# EAGLE design TheLittleEngineers.org-27C512E-TO-2532S-V1R0.20.APRIL.2019 (EAGLE 9.3.2)
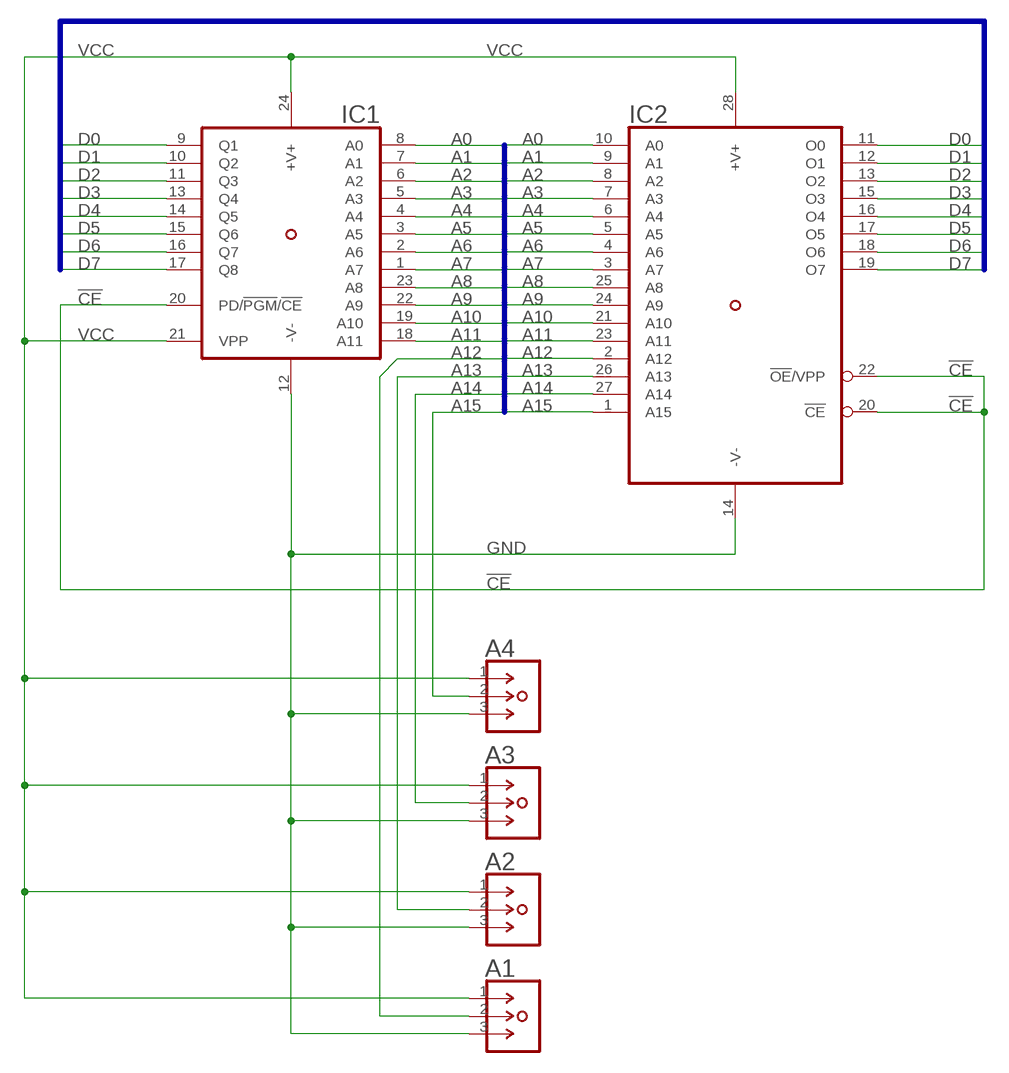
[diagram p0: schematic, sheet 1]

## Parts
A1  HEADER-1X03-STAGGERED-S  [HEADER-1X03-STAGGERED]
A2  HEADER-1X03-STAGGERED-S  [HEADER-1X03-STAGGERED]
A3  HEADER-1X03-STAGGERED-S  [HEADER-1X03-STAGGERED]
A4  HEADER-1X03-STAGGERED-S  [HEADER-1X03-STAGGERED]
IC1  2532-NO  [DIL24-6-NO-OUTLINE]
IC2  27C512D-NO  [DIL28-6-NO-OUTLINE]

## Nets
!CE: IC1.20(PD/!PGM!/!CE) IC2.20(!CE) IC2.22(!OE!/VPP)
A0: IC1.8(A0) IC2.10(A0)
A1: IC1.7(A1) IC2.9(A1)
A2: IC1.6(A2) IC2.8(A2)
A3: IC1.5(A3) IC2.7(A3)
A4: IC1.4(A4) IC2.6(A4)
A5: IC1.3(A5) IC2.5(A5)
A6: IC1.2(A6) IC2.4(A6)
A7: IC1.1(A7) IC2.3(A7)
A8: IC1.23(A8) IC2.25(A8)
A9: IC1.22(A9) IC2.24(A9)
A10: IC1.19(A10) IC2.21(A10)
A11: IC1.18(A11) IC2.23(A11)
A12: A1.2 IC2.2(A12)
A13: A2.2 IC2.26(A13)
A14: A3.2 IC2.27(A14)
A15: A4.2 IC2.1(A15)
D0: IC1.9(Q1) IC2.11(O0)
D1: IC1.10(Q2) IC2.12(O1)
D2: IC1.11(Q3) IC2.13(O2)
D3: IC1.13(Q4) IC2.15(O3)
D4: IC1.14(Q5) IC2.16(O4)
D5: IC1.15(Q6) IC2.17(O5)
D6: IC1.16(Q7) IC2.18(O6)
D7: IC1.17(Q8) IC2.19(O7)
GND [power]: A1.3 A2.3 A3.3 A4.3 IC1.12(-V-) IC2.14(-V-)
VCC [power]: A1.1 A2.1 A3.1 A4.1 IC1.21(VPP) IC1.24(+V+) IC2.28(+V+)

## Buses
D[0..7]
A[0..15]

## Library data of the parts
A1-A4 = 27C512E-TO-2532S-V1R0.20.APRIL.2019-JOHN.ROESNER:HEADER-1X03-STAGGERED: 3-Pin SIP Header Copyright ©07 Jan 2013, by: Robert "The R.A.T." Allen Turner http://www.TheLittleEngineers.org/ TheLittleEngineers@outlook.com OurLittleEngineers@gMail.com You may use these components in your own projects, however, please take note that we CANNOT guarantee the accuracy of these components (nor any part of this library). We make NO guarantees that the components, footprints or schematic symbols in this library are flawless, and we make no promises of fitness for production, prototyping or any other purpose. These libraries are provided for informational purposes only, and are used at your own discretion. By downloading these libraries, you agree that we cannot be held responsible for faulty PCBs. You should always check the footprints with a 1:1 printout. Neither Robert Allen Turner, The Little Engineers <http://www.TheLittleEngineers.org/>, TheLittleEngineers.org, nor anyone affiliated with same shall be held responsible for any outcome resulting from the usage of these files. Should any errors be found, please contact us at one of the above email addresses and we will attempt to repair them. Unless otherwise noted, content of this library is licensed under a Creative Commons Attribution-ShareAlike 4.0 International (CC BY-SA 4.0) license (https://creativecommons.org/licenses/by-sa/4.0/) on 20 April 2019 in memory of my Father, Robert Embry Turner - I LOVE YOU DAD!
IC1 = 27C512E-TO-2532S-V1R0.20.APRIL.2019-JOHN.ROESNER:2532: TMS2532 Copyright ©07 Jan 2013, by: Robert "The R.A.T." Allen Turner http://www.TheLittleEngineers.org/ TheLittleEngineers@outlook.com OurLittleEngineers@gMail.com You may use these components in your own projects, however, please take note that we CANNOT guarantee the accuracy of these components (nor any part of this library). We make NO guarantees that the components, footprints or schematic symbols in this library are flawless, and we make no promises of fitness for production, prototyping or any other purpose. These libraries are provided for informational purposes only, and are used at your own discretion. By downloading these libraries, you agree that we cannot be held responsible for faulty PCBs. You should always check the footprints with a 1:1 printout. Neither Robert Allen Turner, The Little Engineers <http://www.TheLittleEngineers.org/>, TheLittleEngineers.org, nor anyone affiliated with same shall be held responsible for any outcome resulting from the usage of these files. Should any errors be found, please contact us at one of the above email addresses and we will attempt to repair them. Unless otherwise noted, content of this library is licensed under a Creative Commons Attribution-ShareAlike 4.0 International (CC BY-SA 4.0) license (https://creativecommons.org/licenses/by-sa/4.0/) on 20 April 2019 in memory of my Father, Robert Embry Turner - I LOVE YOU DAD!
IC2 = 27C512E-TO-2532S-V1R0.20.APRIL.2019-JOHN.ROESNER:27C512D: 27C512D Copyright ©07 Jan 2013, by: Robert "The R.A.T." Allen Turner http://www.TheLittleEngineers.org/ TheLittleEngineers@outlook.com OurLittleEngineers@gMail.com You may use these components in your own projects, however, please take note that we CANNOT guarantee the accuracy of these components (nor any part of this library). We make NO guarantees that the components, footprints or schematic symbols in this library are flawless, and we make no promises of fitness for production, prototyping or any other purpose. These libraries are provided for informational purposes only, and are used at your own discretion. By downloading these libraries, you agree that we cannot be held responsible for faulty PCBs. You should always check the footprints with a 1:1 printout. Neither Robert Allen Turner, The Little Engineers <http://www.TheLittleEngineers.org/>, TheLittleEngineers.org, nor anyone affiliated with same shall be held responsible for any outcome resulting from the usage of these files. Should any errors be found, please contact us at one of the above email addresses and we will attempt to repair them. Unless otherwise noted, content of this library is licensed under a Creative Commons Attribution-ShareAlike 4.0 International (CC BY-SA 4.0) license (https://creativecommons.org/licenses/by-sa/4.0/) on 20 April 2019 in memory of my Father, Robert Embry Turner - I LOVE YOU DAD!

## Net classes
0 default: width 0.203 mm, clearance 0.203 mm
1 power: width 0.381 mm, clearance 0.203 mm

## Board
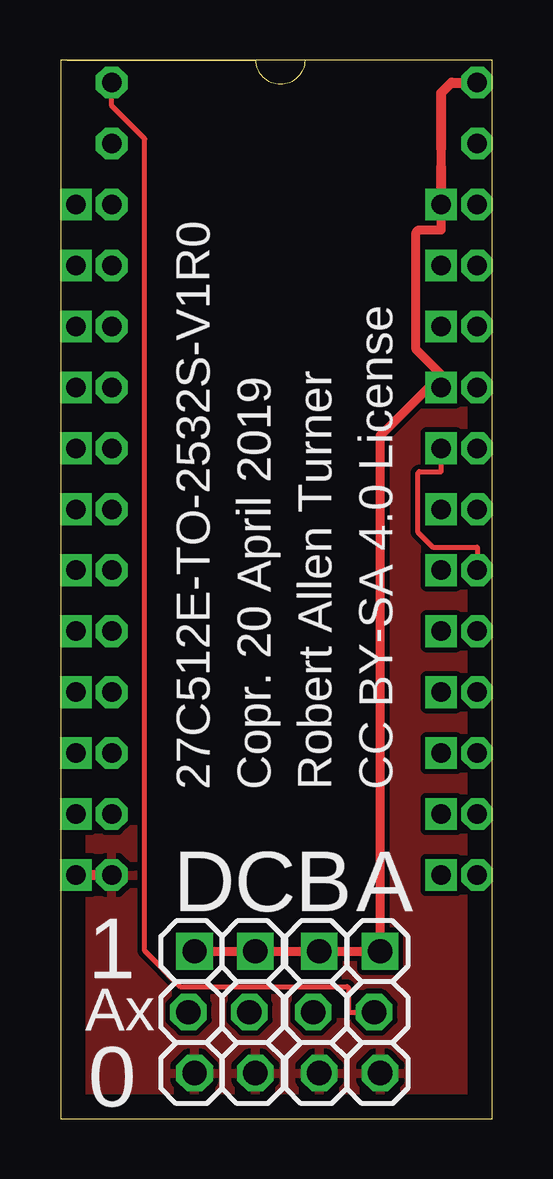
[diagram p1: board, top side]
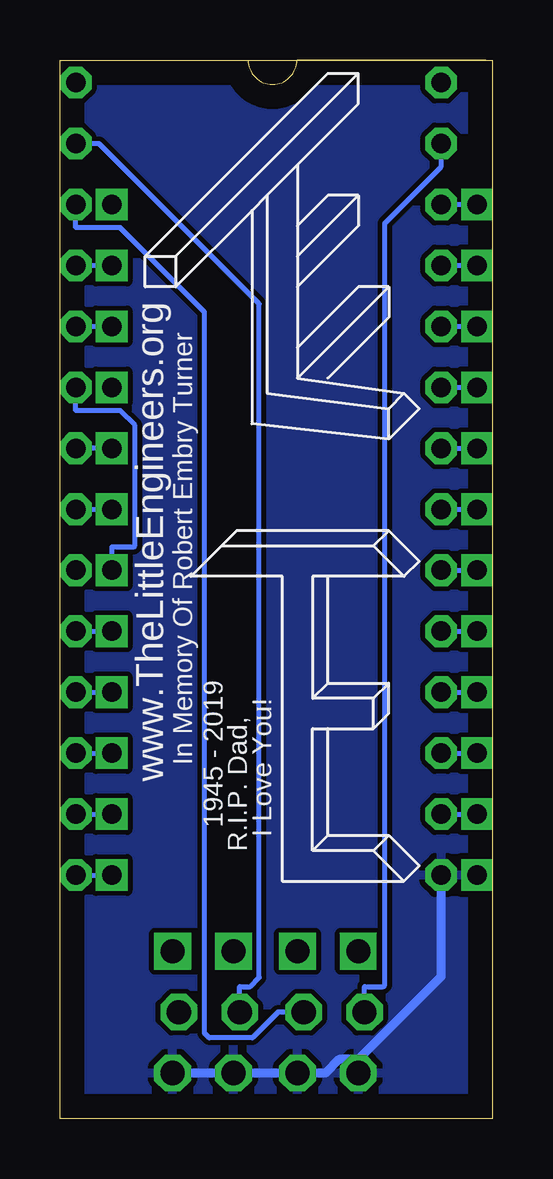
[diagram p2: board, bottom side, seen from below]

Size 18.01 x 44.12 mm. Coordinates in mm from the lower left corner, seen from the top.
Outline: 18.01,44.12 0,44.12 0,0 18.01,0 18.01,44.12
Copper layers (1*16): Top 0.035mm / dielectric 1.5mm / Bottom 0.035mm
Design rules "default": minimum track width 10mil, minimum drill 24mil, track to track 8mil, track to pad 8mil, pad to pad 8mil, via to via 8mil, smd to smd 8mil, copper to edge 40mil, drill to drill 8mil, minimum pad ring 10mil, minimum via ring 8mil, stop-mask expansion 4mil, vias tented up to drill 0mil, thermal gap 10mil

### Footprints (pad centres in the part's own frame; a part is rotated, then mirrored left to right if it is on the bottom)
HEADER-1X03-STAGGERED = drill 1.016 square: 1 -2.54,0.127 | drill 1.016 octagon: 2 0,-0.127; 3 2.54,0.127
DIL24-6-NO-OUTLINE = drill 0.813 square: 1 -13.97,-7.62; 2 -11.43,-7.62; 3 -8.89,-7.62; 4 -6.35,-7.62; 5 -3.81,-7.62; 6 -1.27,-7.62; 7 1.27,-7.62; 8 3.81,-7.62; 9 6.35,-7.62; 10 8.89,-7.62; 11 11.43,-7.62; 12 13.97,-7.62; 13 13.97,7.62; 14 11.43,7.62; 15 8.89,7.62; 16 6.35,7.62; 17 3.81,7.62; 18 1.27,7.62; 19 -1.27,7.62; 20 -3.81,7.62; 21 -6.35,7.62; 22 -8.89,7.62; 23 -11.43,7.62; 24 -13.97,7.62
DIL28-6-NO-OUTLINE = drill 0.813 octagon: 1 -16.51,-7.62; 2 -13.97,-7.62; 3 -11.43,-7.62; 4 -8.89,-7.62; 5 -6.35,-7.62; 6 -3.81,-7.62; 7 -1.27,-7.62; 8 1.27,-7.62; 9 3.81,-7.62; 10 6.35,-7.62; 11 8.89,-7.62; 12 11.43,-7.62; 13 13.97,-7.62; 14 16.51,-7.62; 15 16.51,7.62; 16 13.97,7.62; 17 11.43,7.62; 18 8.89,7.62; 19 6.35,7.62; 20 3.81,7.62; 21 1.27,7.62; 22 -1.27,7.62; 23 -3.81,7.62; 24 -6.35,7.62; 25 -8.89,7.62; 26 -11.43,7.62; 27 -13.97,7.62; 28 -16.51,7.62

### Placement (x,y rotation side)
A1  5.46,4.45 270 top
A2  8,4.45 270 top
A3  10.67,4.45 270 top
A4  13.21,4.45 270 top
IC1  8.25,24.13 270 top
IC2  9.75,26.67 270 top
U$1  [OUTLINE]  0.28,42.85 0 top
U$2  [TLE-LOGO-I]  10.03,28.96 0 bottom
U$3  [TLE-LOGO-F]  8.76,9.91 0 bottom

### Tracks (layer width: path | path; a pad name or v marks a point on that pad's centre or on a via)
!CE
  Top 0.203: IC1.20 15.87,26.97 14.96,26.97 14.91,26.92 14.91,24.44 15.52,23.83 17.37,23.83 IC2.20
  Bottom 0.203: IC1.20 IC2.22
A0
  Bottom 0.203: IC2.10 IC1.8
A1
  Bottom 0.203: IC2.9 IC1.7
A2
  Bottom 0.203: IC2.8 IC1.6
A3
  Bottom 0.203: IC2.7 IC1.5
A4
  Bottom 0.203: IC2.6 IC1.4
A5
  Bottom 0.203: IC2.5 IC1.3
A6
  Bottom 0.203: IC2.4 IC1.2
A7
  Bottom 0.203: IC2.3 IC1.1
A8
  Bottom 0.203: IC2.25 IC1.23
A9
  Bottom 0.203: IC2.24 IC1.22
A10
  Bottom 0.203: IC2.21 IC1.19
A11
  Bottom 0.203: IC1.18 15.87,23.83 14.96,23.83 14.91,23.88 14.91,28.9 15.52,29.51 17.37,29.51 IC2.23
A12
  Bottom 0.203: A1.2 5.33,5.51 4.54,5.51 4.49,5.57 4.49,37.32 2.13,39.67 IC2.2
A13
  Bottom 0.203: A2.2 8.94,4.45 10.01,3.38 11.81,3.38 12.01,3.57 12.01,33.62 15.52,37.13 17.37,37.13 IC2.26
A14
  Bottom 0.203: A3.2 10.54,5.51 10.09,5.51 9.72,5.88 9.72,33.96 16.41,40.64 IC2.27
A15
  Top 0.203: A4.2 12.01,4.45 12.01,5.46 11.96,5.51 4.99,5.51 3.51,7 3.51,40.84 2.13,42.21 IC2.1
D0
  Bottom 0.203: IC2.11 IC1.9
D1
  Bottom 0.203: IC2.12 IC1.10
D2
  Bottom 0.203: IC2.13 IC1.11
D3
  Bottom 0.203: IC2.15 IC1.13
D4
  Bottom 0.203: IC2.16 IC1.14
D5
  Bottom 0.203: IC2.17 IC1.15
D6
  Bottom 0.203: IC2.18 IC1.16
D7
  Bottom 0.203: IC2.19 IC1.17
GND
  Top 0.406: IC2.14 IC1.12
  Bottom 0.381: IC2.14 2.13,5.94 5.59,2.48 | A4.3 A3.3 A2.3 6.97,1.9 6.39,2.48 5.59,2.48 | A1.3 5.59,2.48
  pour Bottom: -0.38,44.58 18.29,44.32 18.29,-0.25 -0.38,0
  pour Top: -0.38,44.45 18.42,44.45 18.42,-0.38 -0.38,-0.38
VCC
  Top 0.381: IC1.24 15.87,37.04 14.93,37.04 14.82,36.93 14.82,32.07 15.87,31.01 | 15.87,31.01 13.33,28.47 A4.1 11.95,6.98 A3.1 9.29,6.98 A2.1 6.75,6.98 A1.1 | 15.87,31.01 IC1.21 | 15.87,39.66 15.87,40.43
  Top 0.406: IC1.24 15.87,39.66 | 15.87,40.43 15.87,42.75 16.3,43.18 IC2.28

### Text on the board
tPlace: 27C512E-TO-2532S-V1R0 | Copr. 20 April 2019 | Robert Allen Turner | CC BY-SA 4.0 License | D | C | B | A | 1 | Ax | 0
bPlace: www.TheLittleEngineers.org | In Memory Of Robert Embry Turner | 1945 - 2019 | I Love You! | R.I.P. Dad,